# Altium project CPU.2.PrjPcb
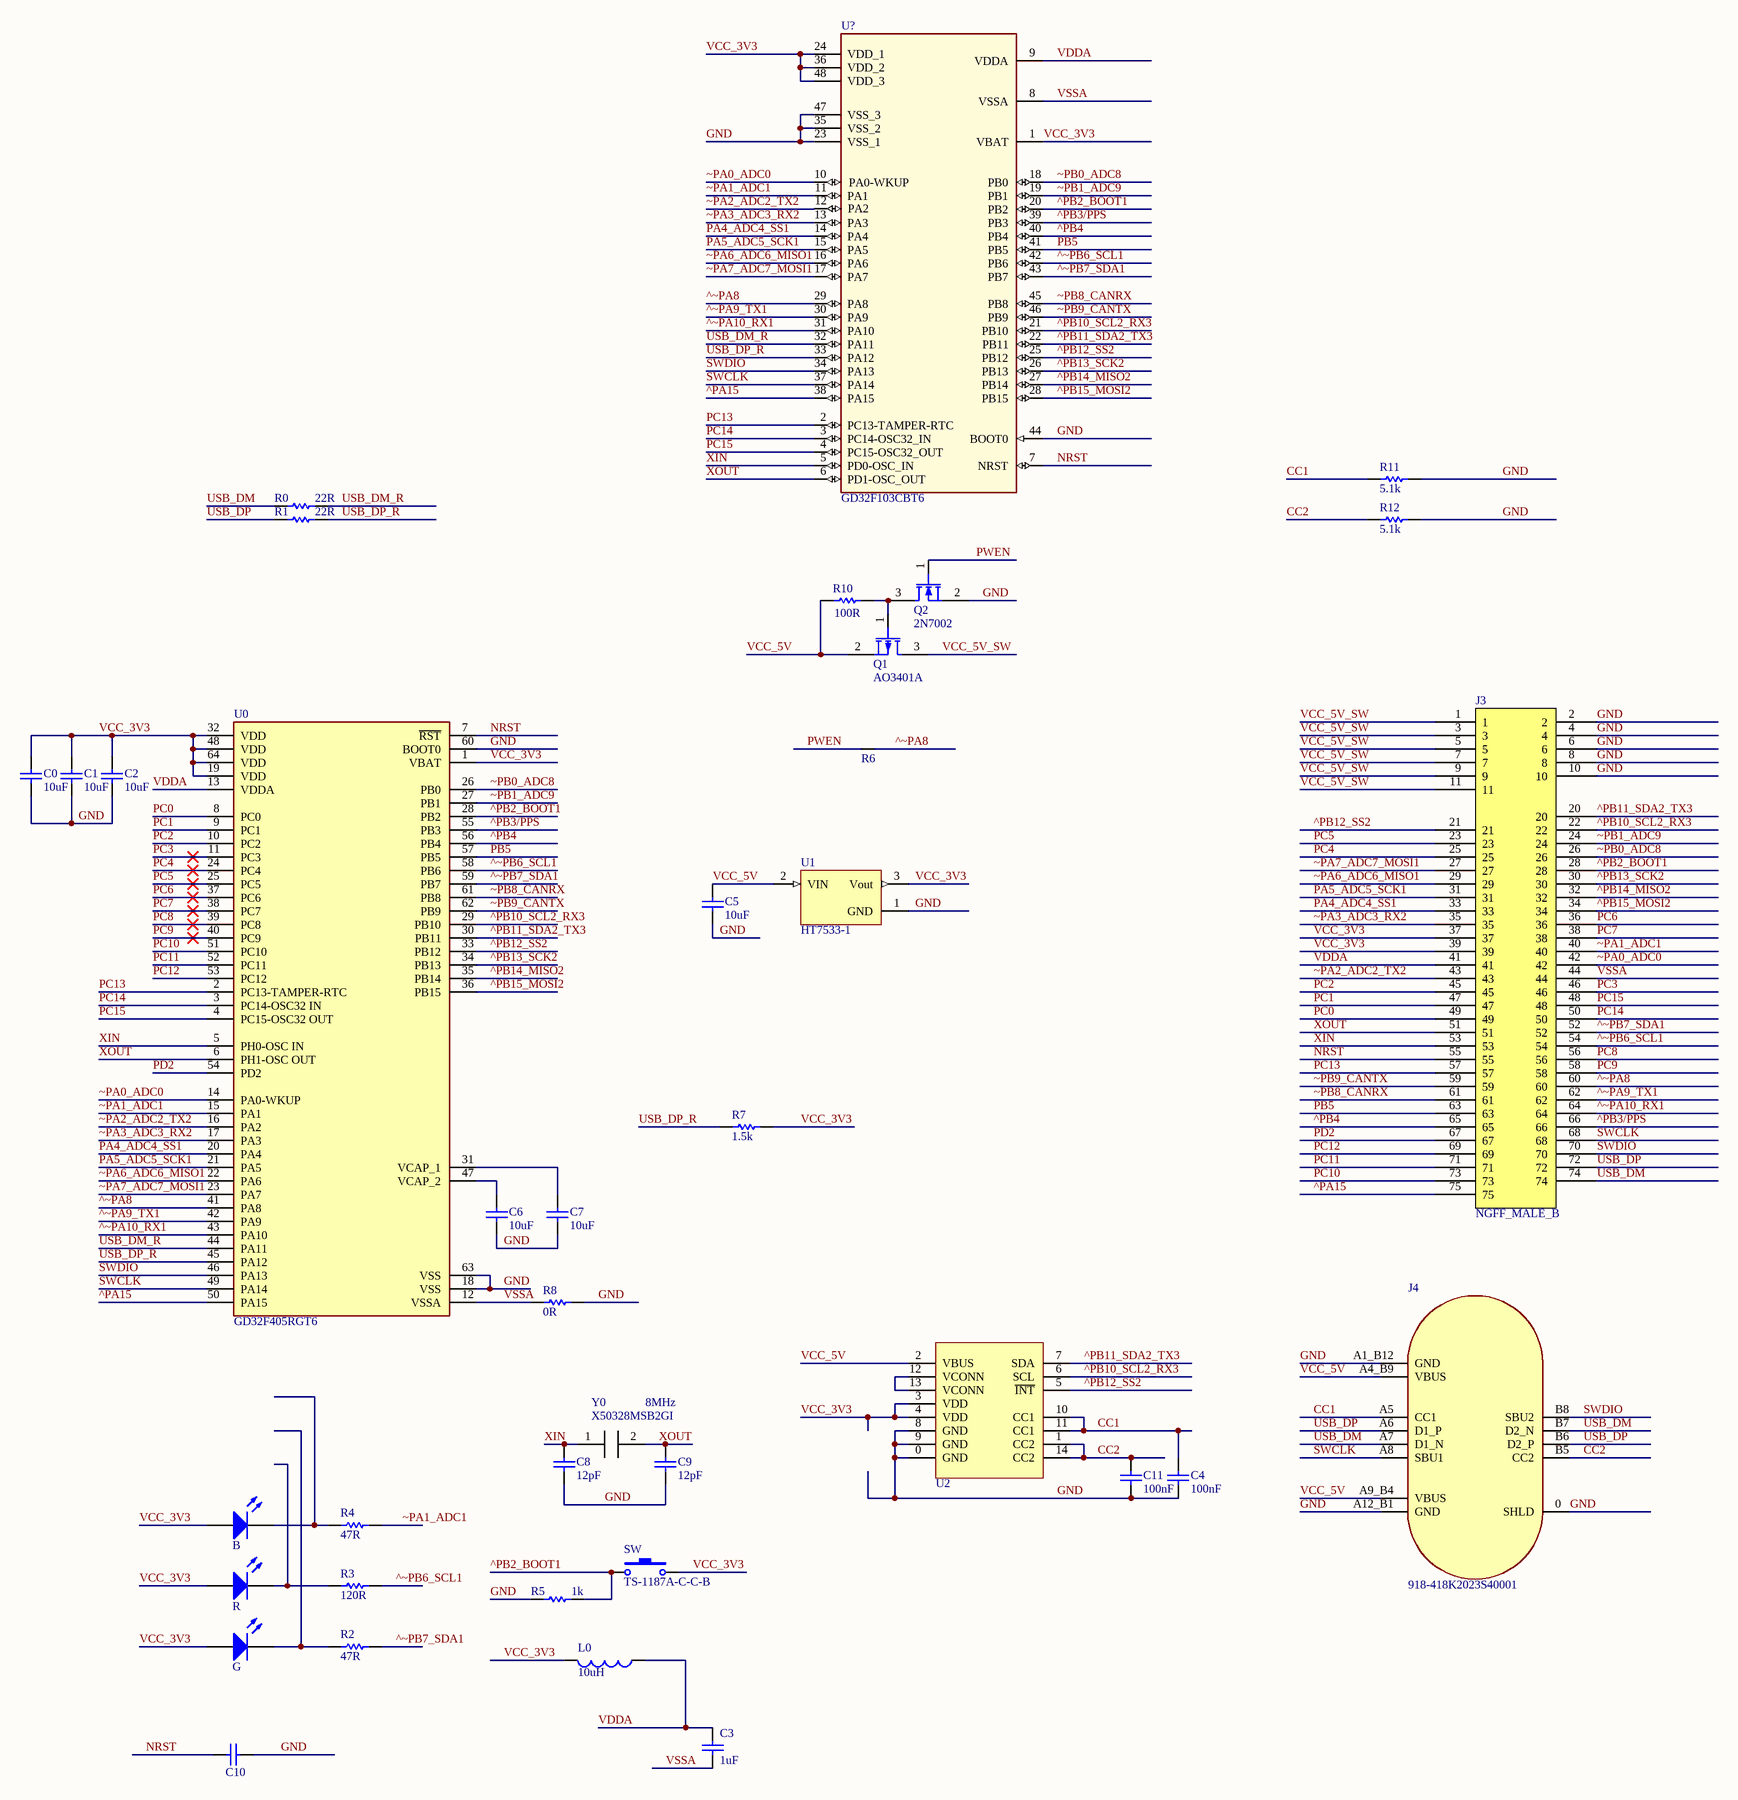
[diagram p0: CPU.2.SchDoc]
1 sheet, 38 parts. Net scope: global (net labels, ports and power ports of the same name join across sheets).
Board file: CPU.2.PcbDoc

## Sheet CPU.2.SchDoc
size C

### Parts
B  19-217/BHC-ZL1M2RY/3T  [D_0603]  (value not drawn)
C0  value 10uF  [C_0402]  (hidden comment: CL05A106MQ5NUNC)
C1  value 10uF  [C_0402]  (hidden comment: CL05A106MQ5NUNC)
C2  value 10uF  [C_0402]  (hidden comment: CL05A106MQ5NUNC)
C3  value 1uF  [C_0402]  (hidden comment: CL05A105KA5NQNC)
C4  value 100nF  [C_0402]  (hidden comment: CL05B104KO5NNNC)
C5  value 10uF  [C_0805]  (hidden comment: CL21A106KAYNNNE)
C6  value 10uF  [C_0402]  (hidden comment: CL05A106MQ5NUNC)
C7  value 10uF  [C_0402]  (hidden comment: CL05A106MQ5NUNC)
C8  value 12pF  [C_0402]  (hidden comment: 0402CG120J500NT)
C9  value 12pF  [C_0402]  (hidden comment: 0402CG120J500NT)
C10  0402CG101J500NT  [C_0402]  (value not drawn)
C11  value 100nF  [C_0402]  (hidden comment: CL05B104KO5NNNC)
G  19-217/GHC-YR1S2/3T  [D_0603]  (value not drawn)
J3  NGFF_MALE_B  [NGFF_MALE_B]
J4  918-418K2023S40001  [DX07S016JA1R1500]
L0  value 10uH  [L_0603]  (hidden comment: SDFL1608S100KTF)
Q1  AO3401A  [TO-236AB]
Q2  2N7002  [TO-236AB]
R  KT-0603R  [D_0603]  (value not drawn)
R0  value 22R  [R_0402]  (hidden comment: 0402WGF220JTCE)
R1  value 22R  [R_0402]  (hidden comment: 0402WGF220JTCE)
R2  value 47R  [R_0402]  (hidden comment: 0402WGF470JTCE)
R3  value 120R  [R_0402]  (hidden comment: 0402WGF1200TCE)
R4  value 47R  [R_0402]  (hidden comment: 0402WGF470JTCE)
R5  value 1k  [R_0402]  (hidden comment: 0402WGF1001TCE)
R6  0  [NET_TIE]  (value not drawn)
R7  value 1.5k  [R_0402]  (hidden comment: 0402WGF1501TCE)
R8  value 0R  [R_0402]  (hidden comment: 0402WGF0000TCE)
R10  value 100R  [R_0402]  (hidden comment: 0402WGF1000TCE)
R11  value 5.1k  [R_0402]  (hidden comment: 0402WGF5101TCE)
R12  value 5.1k  [R_0402]  (hidden comment: 0402WGF5101TCE)
SW  TS-1187A-C-C-B  [TS-1187A-C-C-B]
U0  GD32F405RGT6  [QFP-64-P0.5MM]
U1  HT7533-1  [SOT-223-3]
U2  FUSB302BMPX  [QFN-14-P0.5MM]  (value not drawn)
U?  GD32F103CBT6  [QFP-48-P0.5MM]
Y0  X50328MSB2GI  value 8MHz  [YSX530GA]

### Nets
^PA15: J3.75 U0.50(PA15) U?.38(PA15)
^PB2_BOOT1: J3.28 R5.1 SW.1 U0.28(PB2) U?.20(PB2)
^PB3/PPS: J3.66 U0.55(PB3) U?.39(PB3)
^PB4: J3.65 U0.56(PB4) U?.40(PB4)
^PB10_SCL2_RX3: J3.22 U0.29(PB10) U2.6(SCL) U?.21(PB10)
^PB11_SDA2_TX3: J3.20 U0.30(PB11) U2.7(SDA) U?.22(PB11)
^PB12_SS2: J3.21 U0.33(PB12) U2.5(~{INT}) U?.25(PB12)
^PB13_SCK2: J3.30 U0.34(PB13) U?.26(PB13)
^PB14_MISO2: J3.32 U0.35(PB14) U?.27(PB14)
^PB15_MOSI2: J3.34 U0.36(PB15) U?.28(PB15)
^~PA8: J3.60 R6.2 U0.41(PA8) U?.29(PA8)
^~PA9_TX1: J3.62 U0.42(PA9) U?.30(PA9)
^~PA10_RX1: J3.64 U0.43(PA10) U?.31(PA10)
^~PB6_SCL1: J3.54 R3.1 U0.58(PB6) U?.42(PB6)
^~PB7_SDA1: J3.52 R2.1 U0.59(PB7) U?.43(PB7)
CC1: C4.1 J4.A5(CC1) R11.1 U2.10(CC1) U2.11(CC1)
CC2: C11.1 J4.B5(CC2) R12.1 U2.1(CC2) U2.14(CC2)
GND: C0.1 C1.1 C2.1 C4.2 C5.1 C6.1 C7.1 C8.1 C9.1 C10.1 C11.2 J3.2 J3.4 J3.6 J3.8 J3.10 J4.0(SHLD) J4.A1_B12(GND) J4.A12_B1(GND) Q2.2(S) R5.2 R8.1 R11.2 R12.2 U0.18(VSS) U0.60(BOOT0) U0.63(VSS) U1.1(GND) U2.0(GND) U2.8(GND) U2.9(GND) U?.23(VSS_1) U?.35(VSS_2) U?.44(BOOT0) U?.47(VSS_3)
NRST: C10.2 J3.55 U0.7(~{RST}) U?.7(NRST)
PA4_ADC4_SS1: J3.33 U0.20(PA4) U?.14(PA4)
PA5_ADC5_SCK1: J3.31 U0.21(PA5) U?.15(PA5)
PB5: J3.63 U0.57(PB5) U?.41(PB5)
PC0: J3.49 U0.8(PC0)
PC1: J3.47 U0.9(PC1)
PC2: J3.45 U0.10(PC2)
PC3: J3.46 U0.11(PC3)
PC4: J3.25 U0.24(PC4)
PC5: J3.23 U0.25(PC5)
PC6: J3.36 U0.37(PC6)
PC7: J3.38 U0.38(PC7)
PC8: J3.56 U0.39(PC8)
PC9: J3.58 U0.40(PC9)
PC10: J3.73 U0.51(PC10)
PC11: J3.71 U0.52(PC11)
PC12: J3.69 U0.53(PC12)
PC13: J3.57 U0.2(PC13-TAMPER-RTC) U?.2(PC13-TAMPER-RTC)
PC14: J3.50 U0.3(PC14-OSC32_IN) U?.3(PC14-OSC32_IN)
PC15: J3.48 U0.4(PC15-OSC32_OUT) U?.4(PC15-OSC32_OUT)
PD2: J3.67 U0.54(PD2)
PWEN: Q2.1(G) R6.1
SWCLK: J3.68 J4.A8(SBU1) U0.49(PA14) U?.37(PA14)
SWDIO: J3.70 J4.B8(SBU2) U0.46(PA13) U?.34(PA13)
USB_DM: J3.74 J4.A7(D1_N) J4.B7(D2_N) R0.1
USB_DM_R: R0.2 U0.44(PA11) U?.32(PA11)
USB_DP: J3.72 J4.A6(D1_P) J4.B6(D2_P) R1.1
USB_DP_R: R1.2 R7.1 U0.45(PA12) U?.33(PA12)
VCC_3V3: B.2(A) C0.2 C1.2 C2.2 G.2(A) J3.37 J3.39 L0.2 R.2(A) R7.2 SW.2 U0.1(VBAT) U0.19(VDD) U0.32(VDD) U0.48(VDD) U0.64(VDD) U1.3(Vout) U2.3(VDD) U2.4(VDD) U?.1(VBAT) U?.24(VDD_1) U?.36(VDD_2) U?.48(VDD_3)
VCC_5V: C5.2 J4.A4_B9(VBUS) J4.A9_B4(VBUS) Q1.2(S) R10.1 U1.2(VIN) U2.2(VBUS)
VCC_5V_SW: J3.1 J3.3 J3.5 J3.7 J3.9 J3.11 Q1.3(D)
VDDA: C3.2 J3.41 L0.1 U0.13(VDDA) U?.9(VDDA)
VSSA: C3.1 J3.44 R8.2 U0.12(VSSA) U?.8(VSSA)
XIN: C8.2 J3.53 U0.5(PH0-OSC_IN) U?.5(PD0-OSC_IN) Y0.1
XOUT: C9.2 J3.51 U0.6(PH1-OSC_OUT) U?.6(PD1-OSC_OUT) Y0.2
~PA0_ADC0: J3.42 U0.14(PA0-WKUP) U?.10(PA0-WKUP)
~PA1_ADC1: J3.40 R4.1 U0.15(PA1) U?.11(PA1)
~PA2_ADC2_TX2: J3.43 U0.16(PA2) U?.12(PA2)
~PA3_ADC3_RX2: J3.35 U0.17(PA3) U?.13(PA3)
~PA6_ADC6_MISO1: J3.29 U0.22(PA6) U?.16(PA6)
~PA7_ADC7_MOSI1: J3.27 U0.23(PA7) U?.17(PA7)
~PB0_ADC8: J3.26 U0.26(PB0) U?.18(PB0)
~PB1_ADC9: J3.24 U0.27(PB1) U?.19(PB1)
~PB8_CANRX: J3.61 U0.61(PB8) U?.45(PB8)
~PB9_CANTX: J3.59 U0.62(PB9) U?.46(PB9)
NetB_1: B.1(K) R4.2
NetC6_2: C6.2 U0.47(VCAP_2)
NetC7_2: C7.2 U0.31(VCAP_1)
NetG_1: G.1(K) R2.2
NetQ1_1: Q1.1(G) Q2.3(D) R10.2
NetR_1: R.1(K) R3.2
NetU2_12: U2.12(VCONN) U2.13(VCONN)

### Library data of the parts
B = 19-217/BHC-ZL1M2RY/3T: D - LED - 0603 - Blue; LCSC Part #: C72041; JLC Availability: Basic
C0-C2 C6 C7 = CL05A106MQ5NUNC: C - CAPACITOR - MLCC - 10uF - 6.3V - 0402; WVDC: 6.3; LCSC Part #: C15525; JLC Availability: Basic
C3 = CL05A105KA5NQNC: C - CAPACITOR - MLCC - 1uF - 25V - 0402; WVDC: 16; LCSC Part #: C52923; JLC Availability: Basic
C4 C11 = CL05B104KO5NNNC: C - CAPACITOR - MLCC - 100nF - 16V - 0402; WVDC: 16; LCSC Part #: C1525; JLC Availability: Basic
C5 = CL21A106KAYNNNE: C - CAPACITOR - MLCC - 10uF - 25V - 0805; WVDC: 25; LCSC Part #: C15850; Availability: Basic
C8 C9 = 0402CG120J500NT: C - CAPACITOR - MLCC - 12pF - 50V - 0402; WVDC: 50; LCSC Part #: C1547; JLC Availability: Basic
C10 = 0402CG101J500NT: C - CAPACITOR - MLCC - 100pF - 50V - 0402; LCSC Part #: C1546; JLC Availability: Extended
G = 19-217/GHC-YR1S2/3T: D - LED - 0603 - Green; LCSC Part #: C72043; JLC Availability: Basic
J3 = NGFF_MALE_B: NGFF Male Finger, B Key; Manufacturer: Kyocera; Manufacturer P/N: 245863050024829
J4 = 918-418K2023S40001: J - JACK - USB - Type C - Recepticle - SMT - 90°; JLC Availability: LCSC; LCSC Part #: C167321
L0 = SDFL1608S100KTF: L - INDUCTOR - 10uH - 0603; LCSC Part #: C1035; JLC Availability: Basic
Q1 = AO3401A: Q - TRANSISTOR - MOSFET (P) - 30V - 1.4A - 0.44 Ohm; WVDC: 30; JLC Availability: Basic; LCSC Part #: C15127
Q2 = 2N7002: Q - TRANSISTOR - MOSFET (N) - 60V - 200mW; WVDC: 60; JLC Availability: Basic; LCSC Part #: C8545
R = KT-0603R: D - LED - 0603 - Red; LCSC Part #: C2286; JLC Availability: Basic
R0 R1 = 0402WGF220JTCE: R - RESISTOR - SMD - 22R - 1% - 0402; LCSC Part #: C25092; JLC Availability: Basic
R2 R4 = 0402WGF470JTCE: R - RESISTOR - SMD - 47R - 1% - 0402; LCSC Part #: C25118; JLC Availability: Basic
R3 = 0402WGF1200TCE: R - RESISTOR - SMD - 120R - 1% - 0402; LCSC Part #: C25079; JLC Availability: Basic
R5 = 0402WGF1001TCE: R - RESISTOR - SMD - 1k - 1% - 0402; LCSC Part #: C11702; JLC Availability: Basic
R6 = NET_TIE: R - Net Tie
R7 = 0402WGF1501TCE: R - RESISTOR - SMD - 1.5k - 1% - 0402; LCSC Part #: C25867; JLC Availability: Basic
R8 = 0402WGF0000TCE: R - RESISTOR - SMD - 0R - 1% - 0402; LCSC Part #: C17168; JLC Availability: Basic
R10 = 0402WGF1000TCE: R - RESISTOR - SMD - 100R - 1% - 0402; LCSC Part #: C25076; JLC Availability: Basic
R11 R12 = 0402WGF5101TCE: R - RESISTOR - SMD - 5.1k - 1% - 0402; LCSC Part #: C25905; JLC Availability: Basic
SW = TS-1187A-C-C-B: SW - SWITCH - SPST - NO - Top Actuated Surface Mount; LCSC Part #: C318889; JLC Availability: Extended
U0 = GD32F405RGT6: U - IC - MCU 32BIT 1MB FLASH 64LQFP; ComponentLink2Description: Datasheet; ComponentLink1URL: https://upverter.com/upn/revision/179c87d5c3d4f257/; ComponentLink1Description: Upverter; ComponentLink2URL: http://www.st.com/content/ccc/resource/technical/document/datasheet/33/d4/6f/1d/df/0b/4c/6d/CD00161566.pdf/files/CD00161566.pdf/jcr:content/translations/en.CD00161566.pdf; LCSC Part #: C99031; JLC Availability: Extended
U1 = HT7533-1: U - IC - 3V3 Power Regulator; VOut: 3.3; LCSC Part #: C14289; JLC Availability: Basic
U2 = FUSB302BMPX: U - IC - USB PD PHY; JLC Availability: Extended; LCSC Part #: C442699
U? = GD32F103CBT6: U - IC - MCU, 128 KB Flash, 20 KB Internal RAM, 37 I/Os, 48-pin LQFP, -40 to 85 degC; FLASH Size (Prog) (kB): 128; I/Os (High Current): 37; Internal RAM Size (kB): 20; Operating Frequency(F) (Processor speed) (MHz): 72; ComponentLink1Description: Manufacturer URL; ComponentLink1URL: http://www.st.com/web/en/home.html; ComponentLink2Description: Datasheet; ComponentLink2URL: http://www.st.com/st-web-ui/static/active/en/resource/technical/document/datasheet/CD00161566.pdf; ComponentLink3Description: Package Specification; ComponentLink3URL: http://www.st.com/st-web-ui/static/active/en/resource/technical/document/datasheet/DM00058181.pdf; LCSC Part #: C77979; JLC Availability: Extended
Y0 = X50328MSB2GI: Y - RESONATOR - 8MHZ ±10PPM - SMD-5032; Availability: Basic; LCSC Part #: C115962

## Assembly variants
F4: not fitted U?
F1: not fitted U0